# EAGLE design Reader nano (EAGLE 7.4.0)
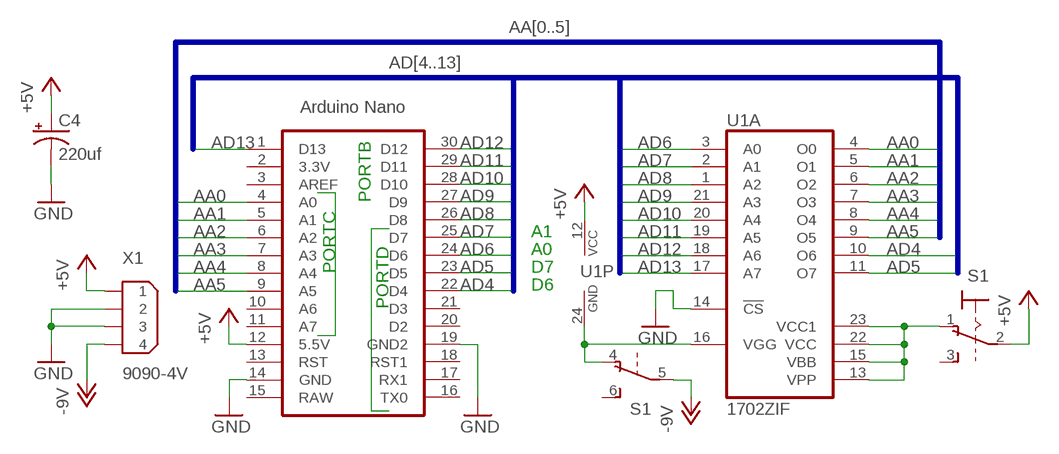
[diagram p0: schematic, sheet 1]

## Parts
C4  220uf  CPOL-USE5-10.5  [E5-10,5]
S1  320-938  [320-938]
U1  1702ZIF  [ZIF24]
U$1  NANO  [NANO]
X1  9090-4V  [9090-4V]

## Nets
+5V [power]: C4.+ S1.2(1:P) U1.12(P:VCC) U$1.12(5.5V) X1.1
-12V: S1.5(B:P) X1.4 ; supply symbol labelled -9V
AA0: U1.4(A:O0) U$1.4(A0)
AA1: U1.5(A:O1) U$1.5(A1)
AA2: U1.6(A:O2) U$1.6(A2)
AA3: U1.7(A:O3) U$1.7(A3)
AA4: U1.8(A:O4) U$1.8(A4)
AA5: U1.9(A:O5) U$1.9(A5)
AD4: U1.10(A:O6) U$1.22(D4)
AD5: U1.11(A:O7) U$1.23(D5)
AD6: U1.3(A:A0) U$1.24(D6)
AD7: U1.2(A:A1) U$1.25(D7)
AD8: U1.1(A:A2) U$1.26(D8)
AD9: U1.21(A:A3) U$1.27(D9)
AD10: U1.20(A:A4) U$1.28(D10)
AD11: U1.19(A:A5) U$1.29(D11)
AD12: U1.18(A:A6) U$1.30(D12)
AD13: U1.17(A:A7) U$1.1(D13)
GND [power]: C4.- U1.14(A:!CS) U$1.14(GND) U$1.19(GND2) X1.2 X1.3
N$1 [power]: S1.1(1:O) U1.13(A:VPP) U1.15(A:VBB) U1.22(A:VCC) U1.23(A:VCC1)
N$3: S1.4(B:O) U1.16(A:VGG) U1.24(P:GND)
Unconnected: S1.3(1:S) S1.6(B:S) U$1.2(3.3V) U$1.3(AREF) U$1.10(A6) U$1.11(A7) U$1.13(RST) U$1.15(RAW) U$1.16(TX0) U$1.17(RX1) U$1.18(RST1) U$1.20(D2) U$1.21(D3)

## Buses
AA[0..5]
AD[4..13]

## Notes on the sheet
- PORTB
- A1
- A0
- PORTC | D7
- D6
- PORTD

## Library data of the parts
C4 = rcl:CPOL-US: POLARIZED CAPACITOR, American symbol
S1 = switch:320-938: TOGGLE SWITCH distributor RS Components
U1 = memory:1702
U$1 = Arduino-clone:NANO: Arduino Nano
X1 = con-thomas-betts:9090-4: Disk Drive Power four position Source: Thomas & Betts Electronic Interconnects Eiropean Edition 1998; OC_FARNELL: unknown; OC_NEWARK: unknown

## Net classes
1 power: width 0.508 mm

## Board
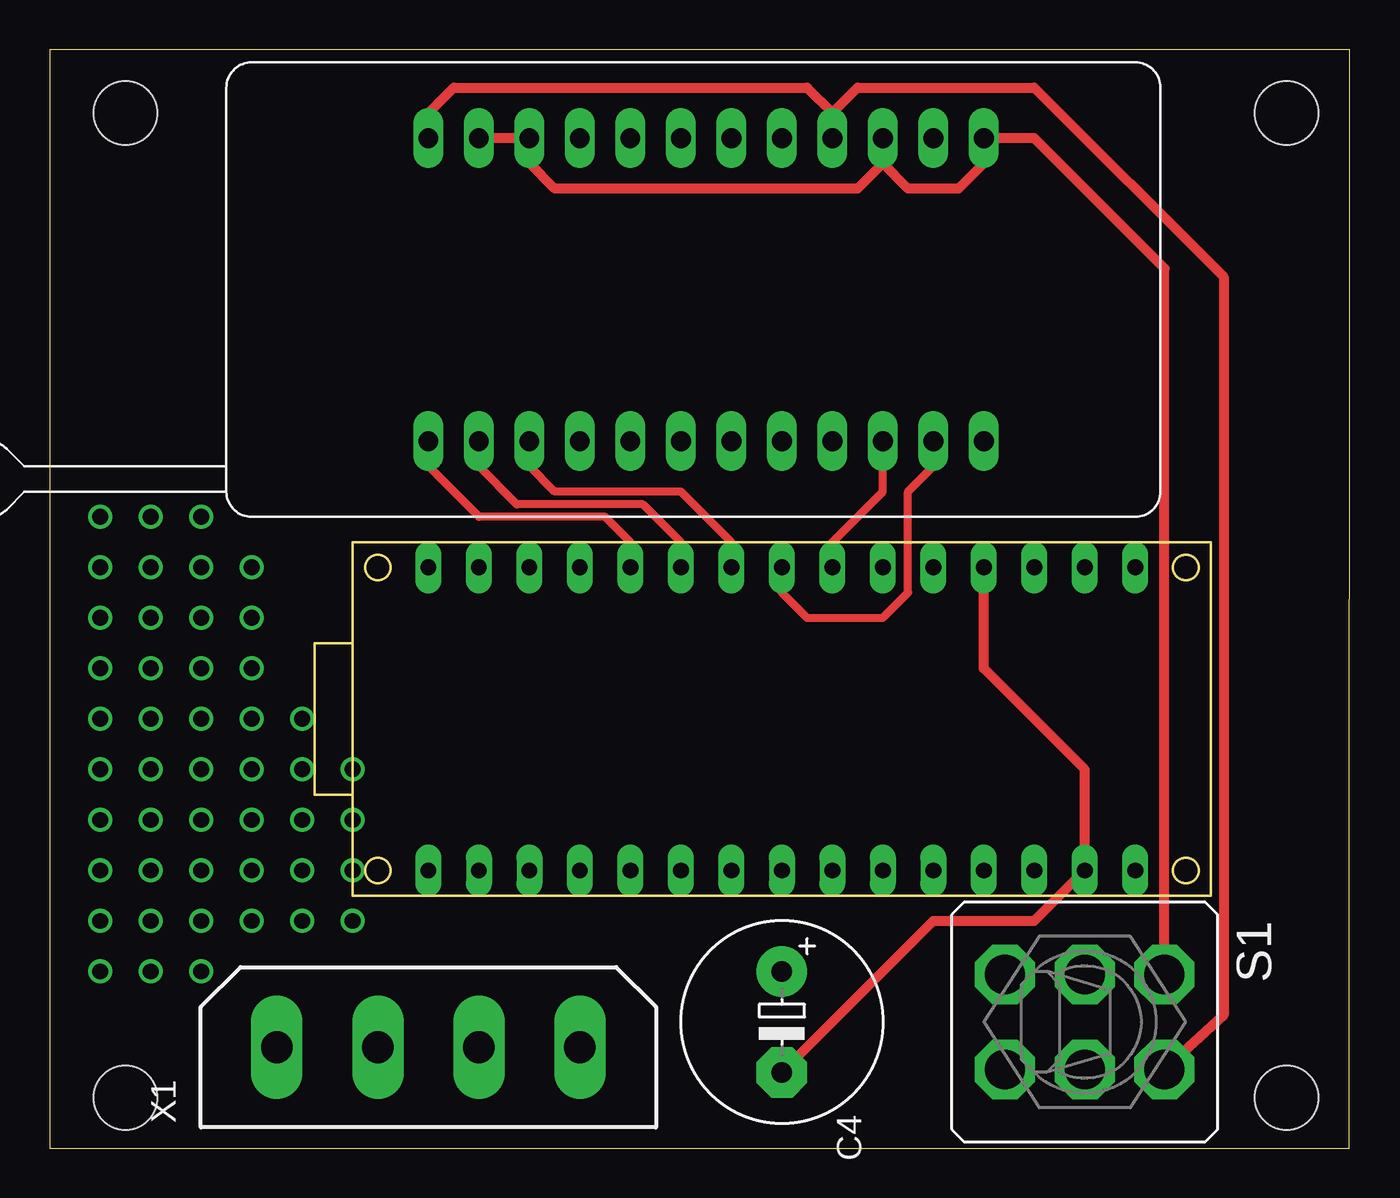
[diagram p1: board, top side]
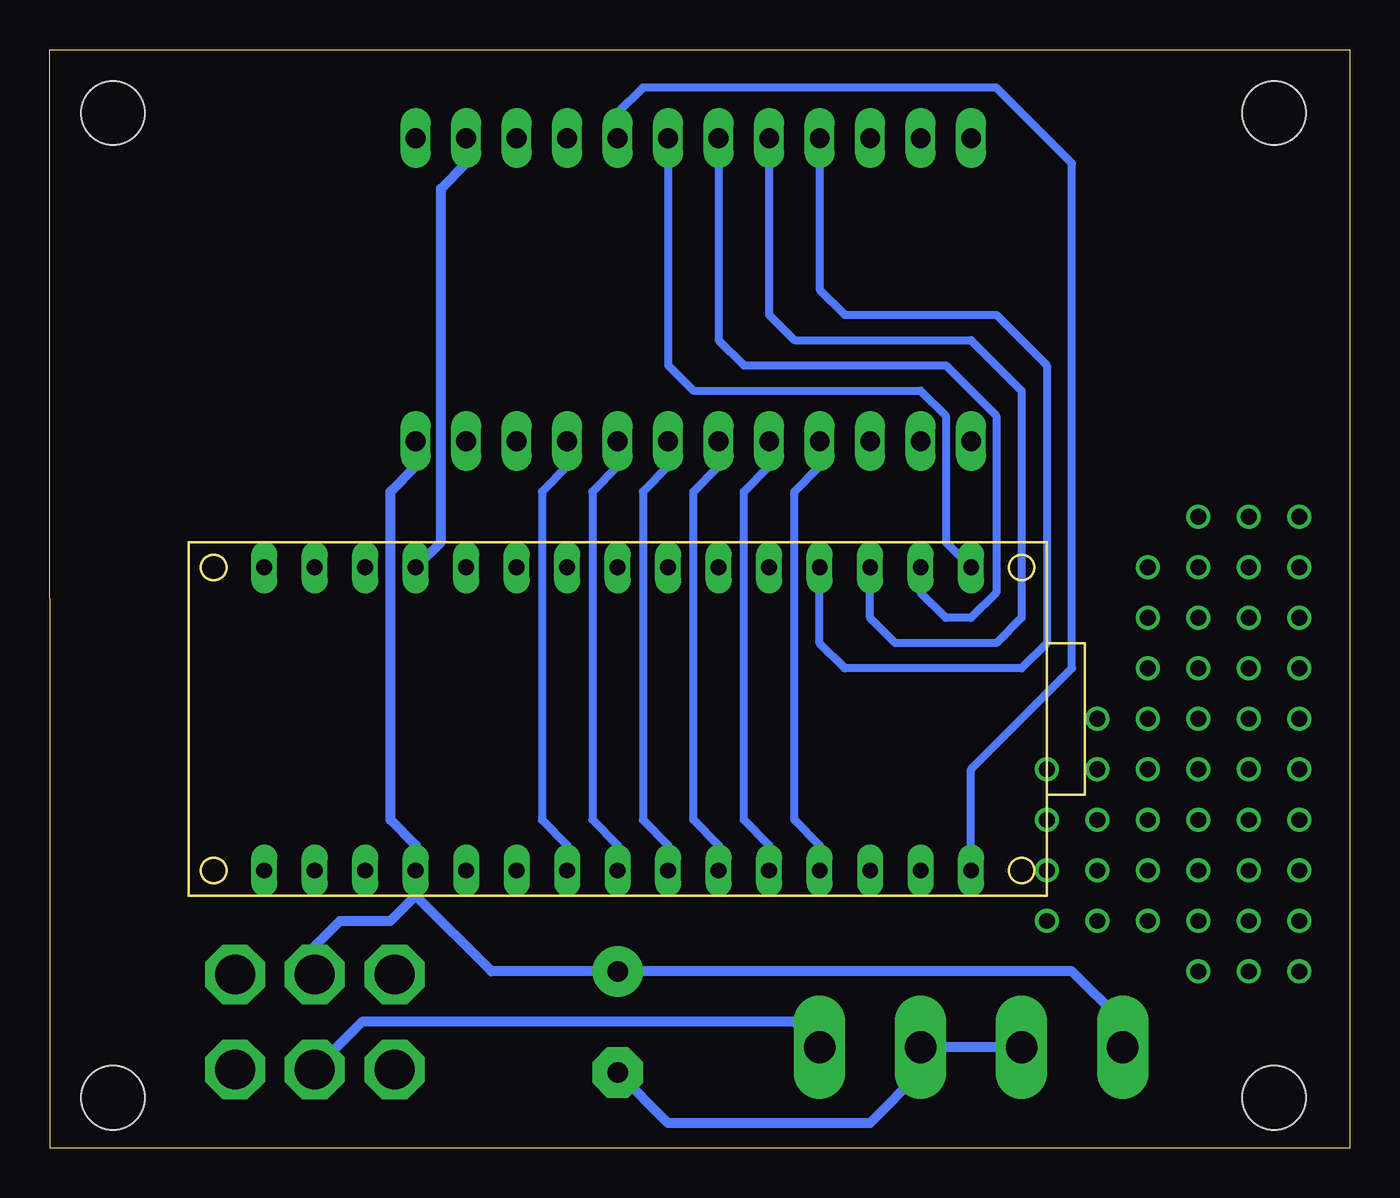
[diagram p2: board, bottom side, seen from below]

Size 65.41 x 55.24 mm. Coordinates in mm from the lower left corner, seen from the top.
Outline: 0,0 65.39,0 65.41,55.24 0,55.24 0,0
Copper layers (1*16): Top 0.035mm / dielectric 1.5mm / Bottom 0.035mm
Design rules "default": minimum track width 10mil, minimum drill 24mil, track to track 8mil, track to pad 8mil, pad to pad 8mil, via to via 8mil, smd to smd 8mil, copper to edge 40mil, drill to drill 8mil, minimum pad ring 10mil, minimum via ring 8mil, stop-mask expansion 4mil, vias tented up to drill 0mil, thermal gap 10mil
Holes 3.2 mm at 3.81,2.54 3.81,52.07 62.23,52.07 62.23,2.54

### Footprints (pad centres in the part's own frame; a part is rotated, then mirrored left to right if it is on the bottom)
E5-10,5 = drill 1.016 pad 2.54: + -2.54,0 | drill 1.016 pad 2.54 octagon: - 2.54,0
320-938 = drill 2.007 octagon: 1 -2.388,4.013; 2 -2.388,0; 3 -2.388,-4.013; 4 2.388,4.013; 5 2.388,0; 6 2.388,-4.013
ZIF24 = drill 1 long: 1 -13.97,-7.62; 2 -11.43,-7.62; 3 -8.89,-7.62; 4 -6.35,-7.62; 5 -3.81,-7.62; 6 -1.27,-7.62; 7 1.27,-7.62; 8 3.81,-7.62; 9 6.35,-7.62; 10 8.89,-7.62; 11 11.43,-7.62; 12 13.97,-7.62; 13 13.97,7.62; 14 11.43,7.62; 15 8.89,7.62; 16 6.35,7.62; 17 3.81,7.62; 18 1.27,7.62; 19 -1.27,7.62; 20 -3.81,7.62; 21 -6.35,7.62; 22 -8.89,7.62; 23 -11.43,7.62; 24 -13.97,7.62
NANO = drill 0.8 long: 1 -7.62,17.78; 2 -7.62,15.24; 3 -7.62,12.7; 4 -7.62,10.16; 5 -7.62,7.62; 6 -7.62,5.08; 7 -7.62,2.54; 8 -7.62,0; 9 -7.62,-2.54; 10 -7.62,-5.08; 11 -7.62,-7.62; 12 -7.62,-10.16; 13 -7.62,-12.7; 14 -7.62,-15.24; 15 -7.62,-17.78; 16 7.62,-17.78; 17 7.62,-15.24; 18 7.62,-12.7; 19 7.62,-10.16; 20 7.62,-7.62; 21 7.62,-5.08; 22 7.62,-2.54; 23 7.62,0; 24 7.62,2.54; 25 7.62,5.08; 26 7.62,7.62; 27 7.62,10.16; 28 7.62,12.7; 29 7.62,15.24; 30 7.62,17.78
9090-4V = drill 1.6 pad 2.6 long: 1 -7.62,0; 2 -2.54,0; 3 2.54,0; 4 7.62,0

### Placement (x,y rotation side)
C4  36.83,6.35 270 top
S1  52.07,6.35 270 top
U1  33.02,43.18 0 top
U$1  36.83,21.59 90 top
X1  19.05,5.08 0 top

### Tracks (layer width: path | path; a pad name or v marks a point on that pad's centre or on a via)
+5V
  Bottom 0.508: U1.12 46.99,34.29 48.26,33.02 48.26,16.51 46.99,15.24 U$1.12 46.99,12.7 | X1.1 11.43,6.35 13.97,8.89 C4.+ 43.18,8.89 46.99,12.7 | S1.2 52.07,10.16 50.8,11.43 48.26,11.43 46.99,12.7
-12V
  Bottom 0.508: X1.4 27.94,6.35 49.68,6.35 S1.5
AA0
  Bottom 0.406: U$1.4 26.67,15.24 27.94,16.51 27.94,33.02 26.67,34.29 U1.4
AA1
  Bottom 0.406: U$1.5 29.21,15.24 30.48,16.51 30.48,33.02 29.21,34.29 U1.5
AA2
  Bottom 0.406: U$1.6 31.75,15.24 33.02,16.51 33.02,33.02 31.75,34.29 U1.6
AA3
  Bottom 0.406: U1.7 34.29,34.29 35.56,33.02 35.56,16.51 34.29,15.24 U$1.7
AA4
  Bottom 0.406: U1.8 36.83,34.29 38.1,33.02 38.1,16.51 36.83,15.24 U$1.8
AA5
  Bottom 0.406: U1.9 39.37,34.29 40.64,33.02 40.64,16.51 39.37,15.24 U$1.9
AD4
  Top 0.406: U$1.22 39.37,30.48 41.91,33.02 U1.10
AD5
  Top 0.406: U$1.23 36.83,27.94 38.1,26.67 41.91,26.67 43.18,27.94 43.18,33.02 44.45,34.29 U1.11
AD6
  Top 0.406: U$1.24 34.29,30.48 31.75,33.02 25.4,33.02 24.13,34.29 U1.3
AD7
  Top 0.406: U$1.25 31.75,30.48 29.84,32.38 23.5,32.38 21.59,34.29 U1.2
AD8
  Top 0.406: U$1.26 29.21,30.48 27.94,31.75 21.59,31.75 19.05,34.29 U1.1
AD9
  Bottom 0.406: U1.21 26.67,43.18 25.4,41.91 17.78,41.91 15.24,39.37 15.24,25.4 16.51,24.13 25.4,24.13 26.67,25.4 U$1.27
AD10
  Bottom 0.406: U1.20 29.21,41.91 27.94,40.64 19.05,40.64 16.51,38.1 16.51,26.67 17.78,25.4 22.86,25.4 24.13,26.67 U$1.28
AD11
  Bottom 0.406: U1.19 31.75,40.64 30.48,39.37 20.32,39.37 17.78,36.83 17.78,27.94 19.05,26.67 20.32,26.67 21.59,27.94 U$1.29
AD12
  Bottom 0.406: U1.18 34.29,39.37 33.02,38.1 21.59,38.1 20.32,36.83 20.32,30.48 U$1.30
AD13
  Bottom 0.406: U$1.1 19.05,19.05 13.97,24.13 13.97,49.53 17.78,53.34 35.56,53.34 36.83,52.07 U1.17
GND
  Top 0.508: U$1.19 46.99,24.13 52.07,19.05 U$1.14 49.53,11.43 44.45,11.43 C4.-
  Bottom 0.508: U$1.19 45.72,30.48 45.72,48.26 44.45,49.53 U1.14 | X1.2 X1.3 21.59,3.81 24.13,1.27 34.29,1.27 C4.-
N$1
  Top 0.508: S1.1 56.08,44.25 49.53,50.8 U1.13 46.99,49.53 45.72,48.26 43.18,48.26 41.91,49.53 | U1.15 41.91,49.53 | 41.91,49.53 40.64,48.26 25.4,48.26 24.13,49.53 U1.22 U1.23
N$2  (via drill 0.8)
  other vias: 2.54,13.97
N$3
  Top 0.508: U1.24 19.05,52.07 20.32,53.34 38.1,53.34 39.37,52.07 | U1.16 39.37,52.07 | 39.37,52.07 40.64,53.34 49.53,53.34 59.05,43.81 59.05,6.71 S1.4
N$4  (via drill 0.8)
  other vias: 2.54,19.05
N$5  (via drill 0.8)
  other vias: 5.08,13.97
N$6  (via drill 0.8)
  other vias: 5.08,19.05
N$7  (via drill 0.8)
  other vias: 7.62,13.97
N$8  (via drill 0.8)
  other vias: 7.62,19.05
N$9  (via drill 0.8)
  other vias: 10.16,13.97
N$10  (via drill 0.8)
  other vias: 10.16,19.05
N$11  (via drill 0.8)
  other vias: 12.7,13.97
N$12  (via drill 0.8)
  other vias: 12.7,19.05
N$13  (via drill 0.8)
  other vias: 2.54,16.51
N$14  (via drill 0.8)
  other vias: 2.54,21.59
N$15  (via drill 0.8)
  other vias: 5.08,16.51
N$16  (via drill 0.8)
  other vias: 5.08,21.59
N$17  (via drill 0.8)
  other vias: 7.62,16.51
N$18  (via drill 0.8)
  other vias: 7.62,21.59
N$19  (via drill 0.8)
  other vias: 10.16,16.51
N$20  (via drill 0.8)
  other vias: 10.16,21.59
N$21  (via drill 0.8)
  other vias: 12.7,16.51
N$22  (via drill 0.8)
  other vias: 12.7,21.59
N$23  (via drill 0.8)
  other vias: 2.54,24.13
N$24  (via drill 0.8)
  other vias: 5.08,24.13
N$25  (via drill 0.8)
  other vias: 7.62,24.13
N$26  (via drill 0.8)
  other vias: 10.16,24.13
N$27  (via drill 0.8)
  other vias: 2.54,26.67
N$28  (via drill 0.8)
  other vias: 5.08,26.67
N$29  (via drill 0.8)
  other vias: 7.62,26.67
N$30  (via drill 0.8)
  other vias: 10.16,26.67
N$31  (via drill 0.8)
  other vias: 2.54,29.21
N$32  (via drill 0.8)
  other vias: 5.08,29.21
N$33  (via drill 0.8)
  other vias: 7.62,29.21
N$34  (via drill 0.8)
  other vias: 10.16,29.21
N$35  (via drill 0.8)
  other vias: 2.54,31.75
N$36  (via drill 0.8)
  other vias: 5.08,31.75
N$37  (via drill 0.8)
  other vias: 7.62,31.75
N$39  (via drill 0.8)
  other vias: 2.54,8.89
N$40  (via drill 0.8)
  other vias: 5.08,8.89
N$41  (via drill 0.8)
  other vias: 7.62,8.89
N$44  (via drill 0.8)
  other vias: 2.54,11.43
N$45  (via drill 0.8)
  other vias: 5.08,11.43
N$46  (via drill 0.8)
  other vias: 7.62,11.43
N$47  (via drill 0.8)
  other vias: 10.16,11.43
N$48  (via drill 0.8)
  other vias: 12.7,11.43
N$49  (via drill 0.8)
  other vias: 15.24,13.97
N$50  (via drill 0.8)
  other vias: 15.24,16.51
N$51  (via drill 0.8)
  other vias: 15.24,19.05
N$52  (via drill 0.8)
  other vias: 15.24,11.43